# Altium schematic sheet GPIO-Debug.SchDoc: =ProjectTitle
size 297 x 209 mm; Address1: Address1; Address2: Address2; Address3: Address3; Address4: Address4; SheetNumber: 8; SheetTotal: 16; Scale: 1:1; DocumentType: Схема электрическая принципиальная
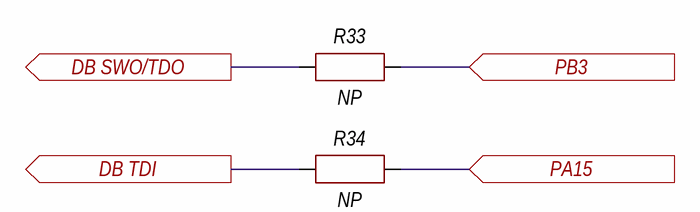
[diagram p0: GPIO-Debug.SchDoc]

## Parts
R33  NP  [CH0402R]
R34  NP  [CH0402R]

## Ports
DB SWO/TDO (out), DB TDI (out), PA15 (in), PB3 (in)

## Nets
DB SWO/TDO: R33.1 ; port DB SWO/TDO
DB TDI: R34.1 ; port DB TDI
PA15: R34.2 ; port PA15
PB3: R33.2 ; port PB3

## Notes on the sheet
- Изм.
- Лист
- № докум.
- Подп.
- Дата
- Копировал
- Формат А4

## Library data of the parts
R33 R34 = Resistor: Value: 0; Manufacturer: *; Model: *; HelpURL: *; ComponentKind: *; NP: NP